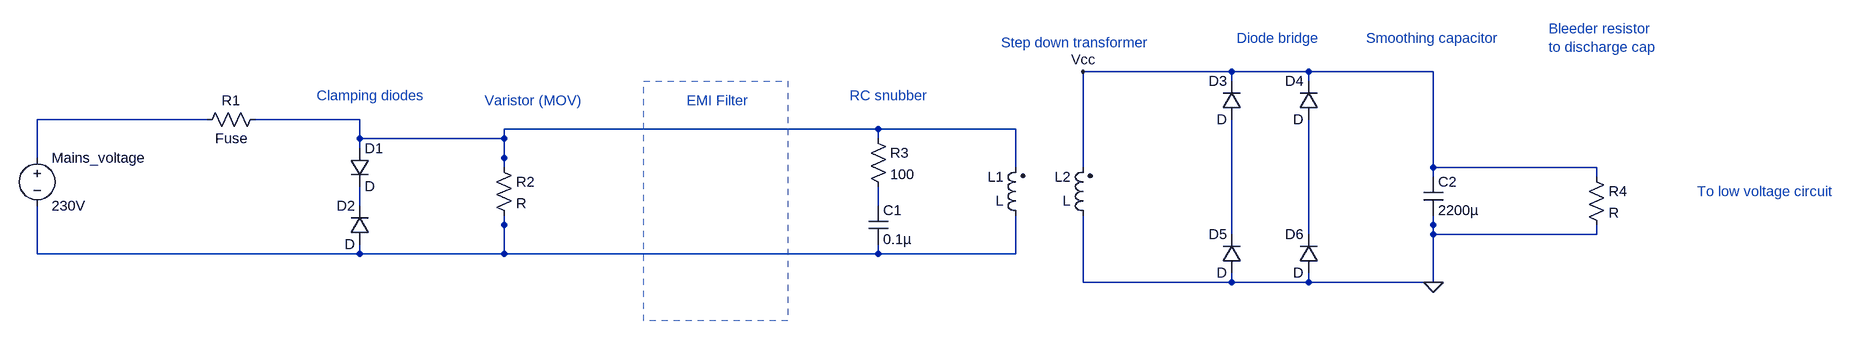
[diagram p0: schematic professional-input-stage.asc]
professional-input-stage.asc, the LTspice schematic file:
Version 4.1
SHEET 1 2796 680
WIRE 2112 272 2112 288
WIRE 1776 368 1776 384
WIRE 1904 368 1904 384
WIRE 1408 272 1408 288
WIRE 2384 288 2384 304
WIRE 2112 288 2112 304
WIRE 2112 304 2384 304
WIRE 2112 288 2112 384
WIRE 2112 384 1904 384
WIRE 1904 384 1776 384
WIRE 1776 384 1408 384
WIRE 1408 384 1408 288
FLAG 2112 384 0
WIRE -640 176 -640 160
WIRE -320 112 -336 112
WIRE -640 160 -640 112
WIRE -640 112 -336 112
WIRE 16 160 16 144
WIRE 1296 192 1296 176
WIRE -240 112 -224 112
WIRE 288 192 288 176
WIRE 992 144 992 128
WIRE 16 144 16 112
WIRE 16 112 -224 112
WIRE 16 144 288 144
WIRE 288 144 288 176
WIRE 288 176 288 128
WIRE 288 128 992 128
WIRE 992 128 1296 128
WIRE 1296 128 1296 176
WIRE 16 224 16 240
WIRE 16 256 16 240
WIRE 992 256 992 240
WIRE 992 224 992 240
WIRE 1776 112 1776 128
WIRE 1776 304 1776 288
WIRE 1776 128 1776 288
WIRE 1904 112 1904 128
WIRE 1904 304 1904 288
WIRE 1904 128 1904 288
WIRE 992 320 992 336
WIRE 16 320 16 336
WIRE 1296 272 1296 288
WIRE -640 256 -640 272
WIRE 288 272 288 288
WIRE 992 336 1296 336
WIRE 1296 336 1296 288
WIRE 992 336 288 336
WIRE 288 336 288 288
WIRE 288 288 288 336
WIRE 288 336 16 336
WIRE 16 336 -640 336
WIRE -640 336 -640 272
WIRE 2112 208 2112 192
WIRE 1776 48 1776 32
WIRE 1904 48 1904 32
WIRE 1408 192 1408 176
WIRE 2384 208 2384 192
WIRE 2112 192 2384 192
WIRE 2112 192 2112 32
WIRE 2112 32 1904 32
WIRE 1904 32 1776 32
WIRE 1776 32 1408 32
WIRE 1408 32 1408 176
FLAG 1408 32 Vcc
SYMBOL res -224 96 R90
WINDOW 0 0 56 VBottom 2
WINDOW 3 32 56 VTop 2
SYMATTR InstName R1
SYMATTR Value Fuse
SYMBOL diode 0 160 R0
SYMATTR InstName D1
SYMBOL diode 32 320 R180
WINDOW 0 24 64 Left 2
WINDOW 3 24 0 Left 2
SYMATTR InstName D2
SYMBOL res 272 176 R0
SYMATTR InstName R2
SYMBOL res 976 128 R0
SYMATTR InstName R3
SYMATTR Value 100
SYMBOL cap 976 256 R0
SYMATTR InstName C1
SYMATTR Value 0.1µ
SYMATTR SpiceLine V=1kV
SYMBOL ind2 1312 288 R180
WINDOW 0 36 80 Left 2
WINDOW 3 36 40 Left 2
SYMATTR InstName L1
SYMATTR Type ind
SYMBOL ind2 1424 288 R180
WINDOW 0 36 80 Left 2
WINDOW 3 36 40 Left 2
SYMATTR InstName L2
SYMATTR Type ind
SYMBOL cap 2096 208 R0
SYMATTR InstName C2
SYMATTR Value 2200µ
SYMBOL res 2368 192 R0
SYMATTR InstName R4
SYMBOL diode 1792 112 R180
WINDOW 0 24 64 Left 2
WINDOW 3 24 0 Left 2
SYMATTR InstName D3
SYMBOL diode 1920 112 R180
WINDOW 0 24 64 Left 2
WINDOW 3 24 0 Left 2
SYMATTR InstName D4
SYMBOL diode 1792 368 R180
WINDOW 0 24 64 Left 2
WINDOW 3 24 0 Left 2
SYMATTR InstName D5
SYMBOL diode 1920 368 R180
WINDOW 0 24 64 Left 2
WINDOW 3 24 0 Left 2
SYMATTR InstName D6
SYMBOL voltage -640 160 R0
WINDOW 123 0 0 Left 0
WINDOW 39 0 0 Left 0
SYMATTR InstName Mains_voltage
SYMATTR Value 230V
TEXT 616 80 Left 2 ;EMI Filter
TEXT -56 72 Left 2 ;Clamping diodes
TEXT 256 80 Left 2 ;Varistor (MOV)
TEXT 944 72 Left 2 ;RC snubber
TEXT 1784 -24 Left 2 ;Diode bridge
TEXT 1272 -16 Left 2 ;Step down transformer
TEXT 2000 -24 Left 2 ;Smoothing capacitor
TEXT 2304 -40 Left 2 ;Bleeder resistor\nto discharge cap
TEXT 2552 232 Left 2 ;To low voltage circuit
RECTANGLE Normal 784 448 544 48 2

The netlist it stands for:
* professional-input-stage.asc
R1 N002 N001 Fuse
D1 N002 N003 D
D2 N007 N003 D
R2 N002 N007 R
R3 N002 N004 100
C1 N004 N007 0.1µ V=1kV
L1 N007 N002 L
L2 0 Vcc L
C2 Vcc 0 2200µ
R4 Vcc 0 R
D3 N005 Vcc D
D4 N006 Vcc D
D5 0 N005 D
D6 0 N006 D
V§Mains_voltage N001 N007 230V
.model D D
.lib standard.dio
* EMI Filter
* Clamping diodes
* Varistor (MOV)
* RC snubber
* Diode bridge
* Step down transformer
* Smoothing capacitor
* Bleeder resistor
* to discharge cap
* To low voltage circuit
.backanno
.end